# Altium schematic sheet Buck.SchDoc
size A4
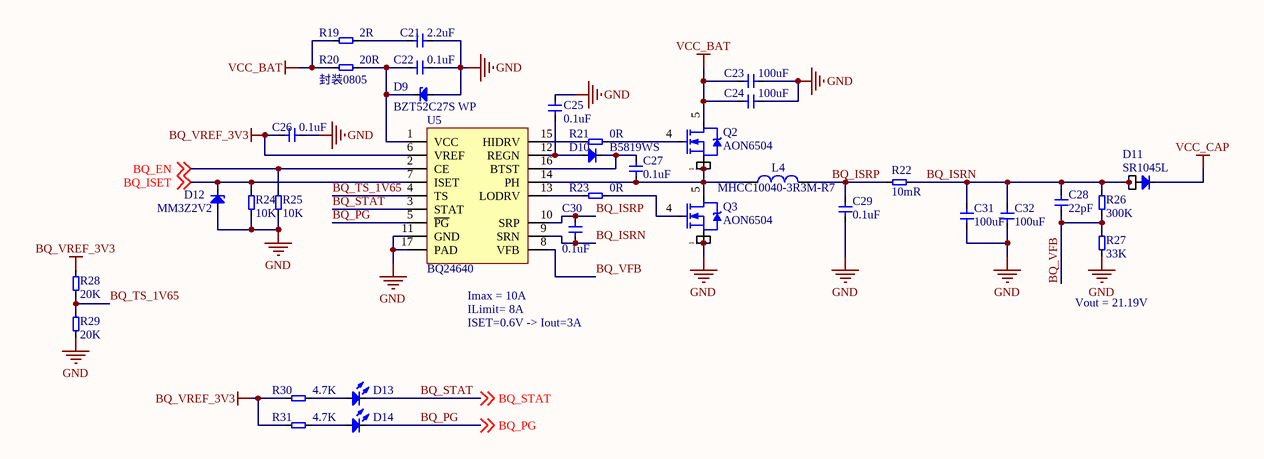
[diagram p0: Buck.SchDoc]

## Parts
C21  2.2uF  [CAP-0603-L]
C22  0.1uF  [CAP-0603-L]
C23  100uF  [CAP-1206-L]
C24  100uF  [CAP-1206-L]
C25  0.1uF  [CAP-0603-L]
C26  0.1uF  [CAP-0603-L]
C27  0.1uF  [CAP-0603-L]
C28  22pF  [CAP-0603-L]
C29  0.1uF  [CAP-0603-L]
C30  0.1uF  [CAP-0603-L]
C31  100uF  [CAP-1206-L]
C32  100uF  [CAP-1206-L]
D9  BZT52C27S WP  [SOD_323]
D10  B5819WS  [SOD_323]
D11  SR1045L  [PowerDi-5]
D12  MM3Z2V2  [SOD_323]
D13  LED_B  [LED_0603-L]  (value not drawn)
D14  LED_G  [LED_0603-L]  (value not drawn)
L4  MHCC10040-3R3M-R7  [L-10040]
Q2  AON6504  [DFN5x6]
Q3  AON6504  [DFN5x6]
R19  2R  [R-0603-L]
R20  20R  [R-0805-L]
R21  0R  [R-0603-L]
R22  10mR  [R-2512-SMALL]
R23  0R  [R-0603-L]
R24  10K  [R-0603-L]
R25  10K  [R-0603-L]
R26  300K  [R-0603-L]
R27  33K  [R-0603-L]
R28  20K  [R-0603-L]
R29  20K  [R-0603-L]
R30  4.7K  [R-0603-L]
R31  4.7K  [R-0603-L]
U5  BQ24640  [VQFN16N]

## Nets
BQ_VREF_3V3: C26.1 R28.2 R30.1 R31.1 U5.6(VREF)
GND: C21.2 C22.2 C23.1 C24.1 C25.2 C26.2 C29.1 C31.1 C32.1 D9.1 D12.1 Q3.1(S) Q3.2(S) Q3.3(S) R24.1 R25.1 R27.1 R29.1 U5.11(GND) U5.17(PAD)
VCC_BAT: C23.2 C24.2 Q2.5(D) R19.1 R20.1
VCC_CAP: D11.3
BQ_EN: R25.2 U5.2(CE) ; off-sheet BQ_EN
BQ_ISET: D12.2 R24.2 U5.7(ISET) ; off-sheet BQ_ISET
BQ_ISRN: C28.2 C30.1 C31.2 C32.2 D11.1 D11.2 R22.2 R26.2 U5.9(SRN)
BQ_ISRP: C29.2 C30.2 L4.2 R22.1 U5.10(SRP)
BQ_PG: D14.2 U5.5(~{PG}) ; off-sheet BQ_PG
BQ_STAT: D13.2 U5.3(STAT) ; off-sheet BQ_STAT
BQ_TS_1V65: R28.1 R29.2 U5.4(TS)
BQ_VFB: C28.1 R26.1 R27.2 U5.8(VFB)
NetC21_1: C21.1 R19.2
NetC22_1: C22.1 D9.2 R20.2 U5.1(VCC)
NetC25_1: C25.1 D10.1 U5.12(REGN)
NetC27_1: C27.1 L4.1 Q2.1(S) Q2.2(S) Q2.3(S) Q3.5(D) U5.14(PH)
NetC27_2: C27.2 D10.2 U5.16(BTST)
NetD13_1: D13.1 R30.2
NetD14_1: D14.1 R31.2
NetQ2_4: Q2.4(G) R21.2
NetQ3_4: Q3.4(G) R23.2
NetR21_1: R21.1 U5.15(HIDRV)
NetR23_1: R23.1 U5.13(LODRV)

## Notes on the sheet
- (near R20) 封装0805
- (near U5) Imax = 10A
- (near R27) Vout = 21.19V
- ILimit= 8A
- ISET=0.6V -> Iout=3A

## Library data of the parts
C21-C32 = CAP
D9 D12 = Diode_ZD
D10 = Diode
D11 = Diode_1
D13 D14 = LED
L4 = Inductor: 电感
Q2 Q3 = MOS-N_1
R19-R31 = Res
U5 = BQ24640: 用于超级电容器的高效同步开关模式电池充电控制器